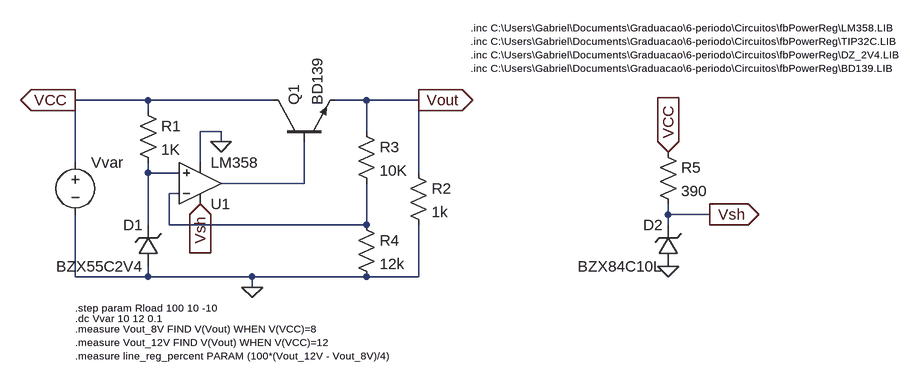
[diagram p0: schematic fbPowerReg.asc]
fbPowerReg.asc, the LTspice schematic file:
Version 4.1
SHEET 1 1264 680
WIRE 48 32 -64 32
WIRE 240 32 48 32
WIRE 384 32 336 32
WIRE 464 32 384 32
WIRE 48 48 48 32
WIRE 160 80 128 80
WIRE 384 80 384 32
WIRE 160 96 160 80
WIRE -64 128 -64 32
WIRE 128 128 128 80
WIRE 48 144 48 128
WIRE 96 144 48 144
WIRE 464 144 464 32
WIRE 288 160 288 96
WIRE 288 160 160 160
WIRE 96 176 80 176
WIRE 848 208 848 192
WIRE 912 208 848 208
WIRE 48 224 48 144
WIRE 80 224 80 176
WIRE 384 224 384 160
WIRE 384 224 80 224
WIRE 848 224 848 208
WIRE -64 304 -64 208
WIRE 48 304 48 288
WIRE 48 304 -64 304
WIRE 208 304 48 304
WIRE 384 304 208 304
WIRE 464 304 464 224
WIRE 464 304 384 304
WIRE 208 320 208 304
FLAG 208 320 0
FLAG 464 32 Vout
IOPIN 464 32 Out
FLAG -64 32 VCC
IOPIN -64 32 Out
FLAG 160 96 0
FLAG 912 208 Vsh
IOPIN 912 208 Out
FLAG 848 112 VCC
IOPIN 848 112 In
FLAG 848 288 0
FLAG 128 192 Vsh
IOPIN 128 192 In
SYMBOL voltage -64 112 R0
SYMATTR InstName Vvar
SYMATTR Value ""
SYMBOL res 32 32 R0
SYMATTR InstName R1
SYMATTR Value 1K
SYMATTR SpiceLine tol=1 pwr=0.1
SYMBOL zener 64 288 R180
WINDOW 0 24 64 Left 2
WINDOW 3 24 0 Left 2
SYMATTR InstName D1
SYMATTR Value BZX55C2V4
SYMBOL res 448 128 R0
SYMATTR InstName R2
SYMATTR Value 1k
SYMBOL res 368 64 R0
SYMATTR InstName R3
SYMATTR Value 10K
SYMATTR SpiceLine tol=1 pwr=0.1
SYMBOL res 368 208 R0
SYMATTR InstName R4
SYMATTR Value 12k
SYMATTR SpiceLine tol=1 pwr=0.1
SYMBOL OpAmps\\opamp2 128 224 M180
SYMATTR InstName U1
SYMATTR Value LM358
SYMBOL zener 864 288 R180
WINDOW 0 24 64 Left 2
WINDOW 3 24 0 Left 2
SYMATTR InstName D2
SYMATTR Value BZX84C10L
SYMBOL res 832 96 R0
SYMATTR InstName R5
SYMATTR Value 390
SYMBOL npn 240 96 R270
SYMATTR InstName Q1
SYMATTR Value BD139
TEXT 544 -80 Left 1 !.inc C:\\Users\\Gabriel\\Documents\\Graduacao\\6-periodo\\Circuitos\\fbPowerReg\\LM358.LIB\n.inc C:\\Users\\Gabriel\\Documents\\Graduacao\\6-periodo\\Circuitos\\fbPowerReg\\TIP32C.LIB\n.inc C:\\Users\\Gabriel\\Documents\\Graduacao\\6-periodo\\Circuitos\\fbPowerReg\\DZ_2V4.LIB\n.inc C:\\Users\\Gabriel\\Documents\\Graduacao\\6-periodo\\Circuitos\\fbPowerReg\\BD139.LIB
TEXT -64 384 Left 1 !.measure Vout_8V FIND V(Vout) WHEN V(VCC)=8\n.measure Vout_12V FIND V(Vout) WHEN V(VCC)=12\n.measure line_reg_percent PARAM (100*(Vout_12V - Vout_8V)/4)
TEXT -64 368 Left 1 !.dc Vvar 10 12 0.1
TEXT -64 352 Left 1 !.step param Rload 100 10 -10

The netlist it stands for:
* fbPowerReg.asc
Vvar VCC 0
R1 VCC N001 1K tol=1 pwr=0.1
D1 0 N001 BZX55C2V4
R2 Vout 0 1k
R3 Vout N003 10K tol=1 pwr=0.1
R4 N003 0 12k tol=1 pwr=0.1
X§U1 N001 N003 Vsh 0 N002 LM358  ; pins In+ In- V+ V- OUT
D2 0 Vsh BZX84C10L
R5 VCC Vsh 390
Q1 VCC N002 Vout 0 BD139
.model D D
.lib standard.dio
.model NPN NPN
.model PNP PNP
.lib standard.bjt
.inc C:\Users\Gabriel\Documents\Graduacao\6-periodo\Circuitos\fbPowerReg\LM358.LIB
.inc C:\Users\Gabriel\Documents\Graduacao\6-periodo\Circuitos\fbPowerReg\TIP32C.LIB
.inc C:\Users\Gabriel\Documents\Graduacao\6-periodo\Circuitos\fbPowerReg\DZ_2V4.LIB
.inc C:\Users\Gabriel\Documents\Graduacao\6-periodo\Circuitos\fbPowerReg\BD139.LIB
.measure Vout_8V FIND V(Vout) WHEN V(VCC)=8
.measure Vout_12V FIND V(Vout) WHEN V(VCC)=12
.measure line_reg_percent PARAM (100*(Vout_12V - Vout_8V)/4)
.dc Vvar 10 12 0.1
.step param Rload 100 10 -10
.backanno
.end

* Results of the author's LTspice run, read from the files saved beside the schematic
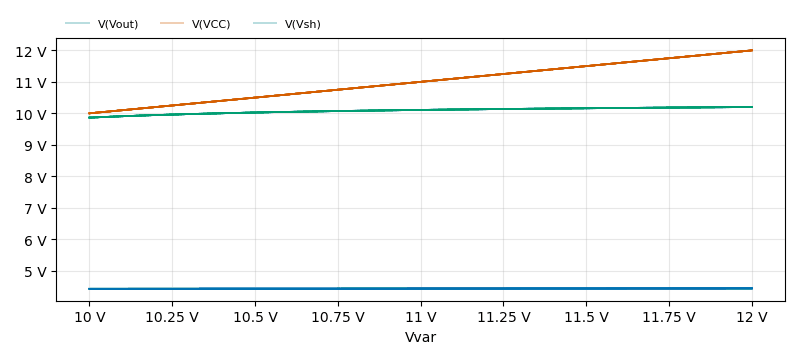
[diagram p1: DC transfer characteristic of fbPowerReg.asc, plotted from the saved traces]
* DC transfer characteristic, 10 runs:
*   V(Vout) [rload=10]: 4.427 V at Vvar=10 V, 4.44 V at Vvar=12 V, min 4.427 V, max 4.44 V
*   V(Vout) [rload=20]: 4.427 V at Vvar=10 V, 4.44 V at Vvar=12 V, min 4.427 V, max 4.44 V
*   V(Vout) [rload=30]: 4.427 V at Vvar=10 V, 4.44 V at Vvar=12 V, min 4.427 V, max 4.44 V
*   V(Vout) [rload=40]: 4.427 V at Vvar=10 V, 4.44 V at Vvar=12 V, min 4.427 V, max 4.44 V
*   V(Vout) [rload=50]: 4.427 V at Vvar=10 V, 4.44 V at Vvar=12 V, min 4.427 V, max 4.44 V
*   V(Vout) [rload=60]: 4.427 V at Vvar=10 V, 4.44 V at Vvar=12 V, min 4.427 V, max 4.44 V
*   V(Vout) [rload=70]: 4.427 V at Vvar=10 V, 4.44 V at Vvar=12 V, min 4.427 V, max 4.44 V
*   V(Vout) [rload=80]: 4.427 V at Vvar=10 V, 4.44 V at Vvar=12 V, min 4.427 V, max 4.44 V
*   V(VCC) [rload=10]: 10 V at Vvar=10 V, 12 V at Vvar=12 V, min 10 V, max 12 V
*   V(VCC) [rload=20]: 10 V at Vvar=10 V, 12 V at Vvar=12 V, min 10 V, max 12 V
*   V(VCC) [rload=30]: 10 V at Vvar=10 V, 12 V at Vvar=12 V, min 10 V, max 12 V
*   V(VCC) [rload=40]: 10 V at Vvar=10 V, 12 V at Vvar=12 V, min 10 V, max 12 V
*   V(VCC) [rload=50]: 10 V at Vvar=10 V, 12 V at Vvar=12 V, min 10 V, max 12 V
*   V(VCC) [rload=60]: 10 V at Vvar=10 V, 12 V at Vvar=12 V, min 10 V, max 12 V
*   V(VCC) [rload=70]: 10 V at Vvar=10 V, 12 V at Vvar=12 V, min 10 V, max 12 V
*   V(VCC) [rload=80]: 10 V at Vvar=10 V, 12 V at Vvar=12 V, min 10 V, max 12 V
*   V(Vsh) [rload=10]: 9.864 V at Vvar=10 V, 10.2 V at Vvar=12 V, min 9.864 V, max 10.2 V
*   V(Vsh) [rload=20]: 9.864 V at Vvar=10 V, 10.2 V at Vvar=12 V, min 9.864 V, max 10.2 V
*   V(Vsh) [rload=30]: 9.864 V at Vvar=10 V, 10.2 V at Vvar=12 V, min 9.864 V, max 10.2 V
*   V(Vsh) [rload=40]: 9.864 V at Vvar=10 V, 10.2 V at Vvar=12 V, min 9.864 V, max 10.2 V
*   V(Vsh) [rload=50]: 9.864 V at Vvar=10 V, 10.2 V at Vvar=12 V, min 9.864 V, max 10.2 V
*   V(Vsh) [rload=60]: 9.864 V at Vvar=10 V, 10.2 V at Vvar=12 V, min 9.864 V, max 10.2 V
*   V(Vsh) [rload=70]: 9.864 V at Vvar=10 V, 10.2 V at Vvar=12 V, min 9.864 V, max 10.2 V
*   V(Vsh) [rload=80]: 9.864 V at Vvar=10 V, 10.2 V at Vvar=12 V, min 9.864 V, max 10.2 V
* From the log:
*   Measurement "vout_8v" FAIL'ed
*   Measurement: vout_12v
*     step  V(Vout)  at
*        1  4.43951320648  12
*        2  4.43951320648  12
*        3  4.43951320648  12
*        4  4.43951320648  12
*        5  4.43951320648  12
*        6  4.43951320648  12
*        7  4.43951320648  12
*        8  4.43951320648  12
*        9  4.43951320648  12
*       10  4.43951320648  12
*   Measurement "line_reg_percent" FAIL'ed